# EAGLE schematic M_G_ext_motor (EAGLE 9.6.2)
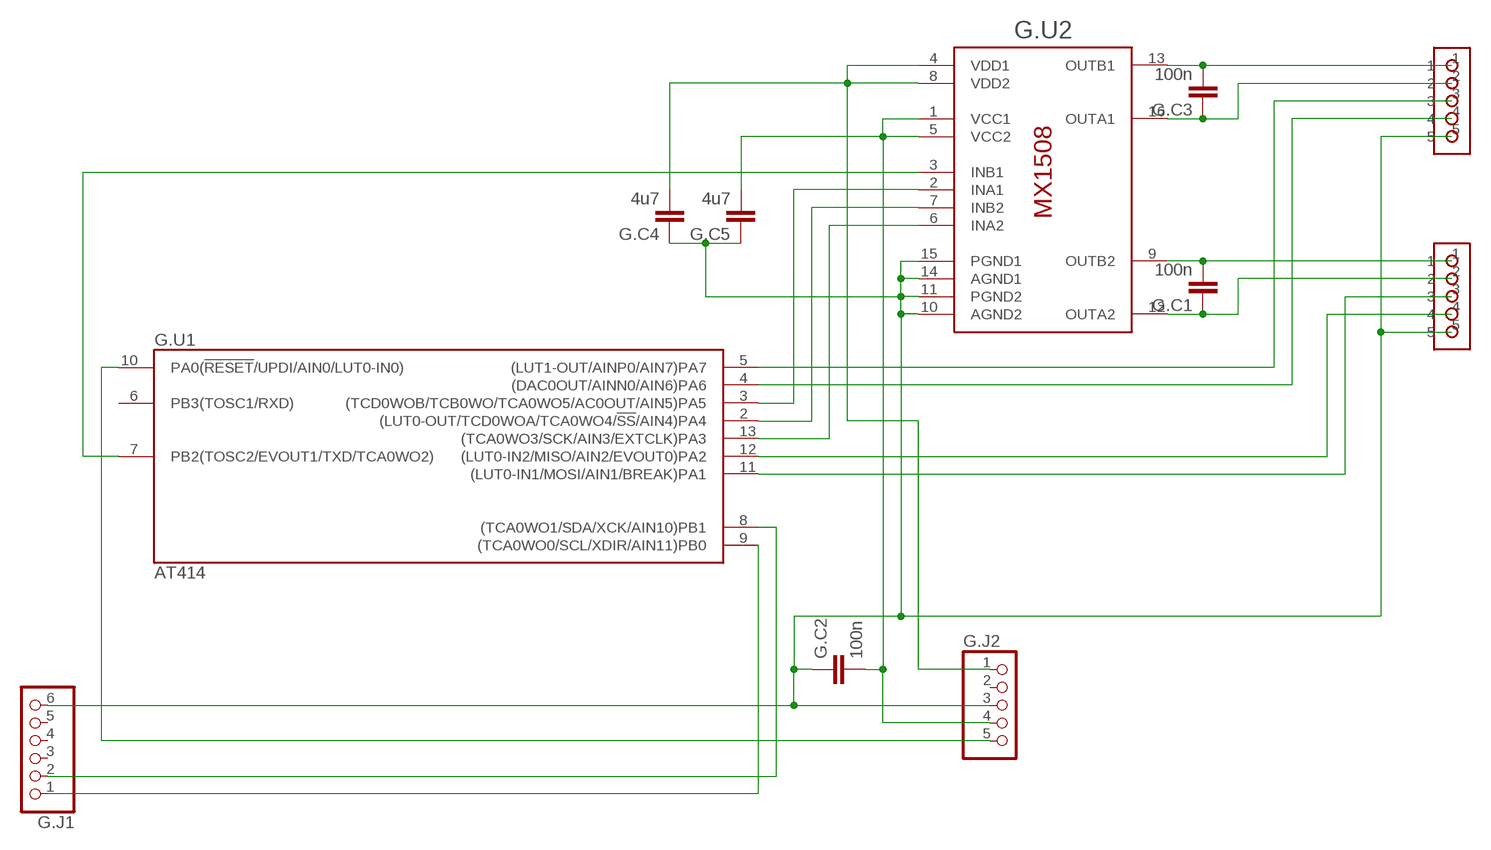
[diagram p0: schematic, sheet 1]

## Parts
G.C1  100n  C-EUC0603  [C0603]
G.C2  100n  C-EUC0603  [C0603]
G.C3  100n  C-EUC0603  [C0603]
G.C4  4u7  C-EUC0603  [C0603]
G.C5  4u7  C-EUC0603  [C0603]
G.J1  PINHD-1X6  [1X06]
G.J2  PINHD-1X5  [1X05]
G.J3  A1250WR  [A1250WR]
G.MOTO1  A1250WR  [A1250WR]
G.U1  AT414  ATTINY414-SSN  [SO14]
G.U2  MX1508  [SOP16]

## Nets
FOTO1: G.MOTO1.3 G.U1.5((LUT1-OUT/AINP0/AIN7)PA7)
FOTO2: G.J3.4 G.U1.12((LUT0-IN2/MISO/AIN2/EVOUT0)PA2)
GND: G.C2.1 G.C4.1 G.C5.1 G.J1.6 G.J2.3 G.J3.5 G.MOTO1.5 G.U2.10(AGND2) G.U2.11(PGND2) G.U2.14(AGND1) G.U2.15(PGND1)
INA1: G.U1.3((TCD0WOB/TCB0WO/TCA0WO5/AC0OUT/AIN5)PA5) G.U2.2(INA1)
INA2: G.U1.13((TCA0WO3/SCK/AIN3/EXTCLK)PA3) G.U2.6(INA2)
INB1: G.U1.7(PB2(TOSC2/EVOUT1/TXD/TCA0WO2)) G.U2.3(INB1)
INB2: G.U1.2((LUT0-OUT/TCD0WOA/TCA0WO4/!SS!/AIN4)PA4) G.U2.7(INB2)
LED1: G.MOTO1.4 G.U1.4((DAC0OUT/AINN0/AIN6)PA6)
LED2: G.J3.3 G.U1.11((LUT0-IN1/MOSI/AIN1/BREAK)PA1)
M1: G.C3.2 G.MOTO1.1 G.U2.13(OUTB1)
M2: G.C3.1 G.MOTO1.2 G.U2.16(OUTA1)
M3: G.C1.2 G.J3.1 G.U2.9(OUTB2)
M4: G.C1.1 G.J3.2 G.U2.12(OUTA2)
M_SRC: G.C4.2 G.J2.1 G.U2.4(VDD1) G.U2.8(VDD2)
N$7: G.J2.5 G.U1.10(PA0(!RESET!/UPDI/AIN0/LUT0-IN0))
N$19: G.J1.1 G.U1.9((TCA0WO0/SCL/XDIR/AIN11)PB0)
N$20: G.J1.2 G.U1.8((TCA0WO1/SDA/XCK/AIN10)PB1)
VCC: G.C2.2 G.C5.2 G.J2.4 G.U2.1(VCC1) G.U2.5(VCC2)
Unconnected: G.J1.3 G.J1.4 G.J1.5 G.J2.2 G.U1.6(PB3(TOSC1/RXD))

## Power pins joined to a net without a drawn wire
GND: G.J3.$1(GND) G.J3.$2(GND) G.MOTO1.$1(GND) G.MOTO1.$2(GND) G.U1.14(GND)
VCC: G.U1.1(VCC)

## Library data of the parts
G.C1-G.C5 = rcl:C-EU: CAPACITOR, European symbol; SPICEPREFIX: C
G.J1 = pinhead2:PINHD-1X6: PIN HEADER
G.J2 = pinhead2:PINHD-1X5: PIN HEADER
G.J3 G.MOTO1 = hugo:A1250WR
G.U1 = atmel:ATTINY*14: 8-bit AVR tiny-1-series Microcontroller CPU: two-cycle hardware multiplier single pin Unified Program Debug Interface (UPDI) programmable watchdog timer with separate on-chip oscillator programmable brown-out detection circuit with software disable function internal calibrated oscillator Status aktiv aktiv aktiv aktiv ATtiny214 ATtiny414 ATtiny814 ATtiny1614 General purpose working registers 32 SRAM 128 B 256 B 512 B 2 kB Program flash memory 2 kB 4 kB 8 kB 16 kB EEPROM 64 B 128 B 128 B 256 B 16-bit Timer/Counter type A (TCA) 1 16-bit Timer/Counter type B (TCB) 1 2 12-bit Timer/Counter type D (TCD) 1 Real Time Counter (RTC) 1 USART 1 SPI 1 TWI (I2C) 1 ADC 1 2 ADC channels 10 10+4 ADC resolution 10 bit DAC 1 3 AC 1 3 Peripheral Touch Controller (PTC) - 1 PTC number of self-capacitance channels - 6 PTC number of mutual-capacitance channels - 9 Custom Configurable Logic/Lookup tables 1/2 Window Watchdog 1 Event System channels 6 General purpose I/O 12 External interrupts 12 CRCSCAN 1 Operating voltage 1.8 ... 5.5 V Speed grade 0 ... 5 MHz @ 1.8 ... 5.5 V 0 ... 10 MHz @ 2.7 ... 5.5 V 0 ... 20 MHz @ 4.5 ... 5.5 V Clock options internal 16/20 MHz low power RC oscillator internal 32.768 kHz ultra low power RC oscillator external 32.768 kHz low-frequency crystal oscillator external clock input Pin Name Other/Special ADC0 ADC1 PTC AC0 AC1 AC2 DAC0 USART0 SPI0 TWI0 TCA0 TCBn TCD0 CCL PA0 !RESET, UPDI AIN0 LUT0-IN0 PA1 AIN1 TxD MOSI SDA LUT0-IN1 PA2 EVOUT0 AIN2 RxD MISO SCL LUT0-IN2 PA3 EXTCLK AIN3 XCK SCK WO3 TCB1 WO PA4 AIN4 AIN0 X0/Y0 XDIR !SS WO4 WOA LUT0-OUT PA5 VREFA AIN5 AIN1 X1/Y1 OUT AINN0 WO5 TCB0 WO WOB PA6 AIN6 AIN2 X2/Y2 AINN0 AINP1 AINP0 OUT PA7 AIN7 AIN3 X3/Y3 AINP0 AINP0 AINN0 LUT1-OUT PB3 TOSC1 OUT RxD WO0 PB2 TOSC2, EVOUT1 OUT TxD WO2 PB1 AIN10 X4/Y4 AINP2 XCK SDA WO1 PB0 AIN11 X5/Y5 AINP2 AINP1 XDIR SCL WO0 only available in devices with 8/16KByte flash, X- or Y-line only available in device ATtiny1614
G.U2 = hugo:MX1508